# Altium schematic sheet SDCard.SchDoc: SD Card
size A4; Date: 2016-06-28; Author: Vitali Tsiukala; DrawnBy: Vitali Tsiukala; Engineer: Vitali Tsiukala; Organization: Trenz Electronic GmbH; DocumentNumber: TE0706; Revision: 02; SheetNumber: 7; SheetTotal: 10
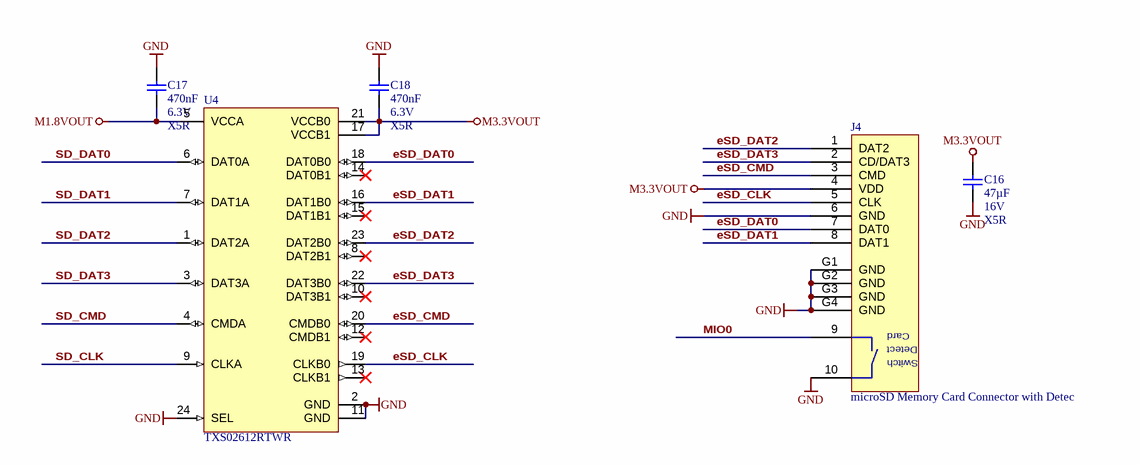
[diagram p0: SDCard.SchDoc]

## Parts
C16  47µF  Voltage: 16V  Technology: X5R  [CAPC3216X180N]
C17  470nF  Voltage: 6.3V  Technology: X5R  [CAPC1005X55N]
C18  470nF  Voltage: 6.3V  Technology: X5R  [CAPC1005X55N]
J4  microSD Memory Card Connector with Detec  [104031-0811]
U4  TXS02612RTWR  [QFN50P400X400X80-25N-255]

## Nets
GND: C16.1 C17.2 C18.2 J4.6(GND) J4.10(CDSW) J4.G1(GND) J4.G2(GND) J4.G3(GND) J4.G4(GND) U4.2(GND) U4.11(GND) U4.24(SEL)
M1.8VOUT: C17.1 U4.5(VCCA)
M3.3VOUT: C16.2 C18.1 J4.4(VDD) U4.17(VCCB1) U4.21(VCCB0)
eSD_CLK: J4.5(CLK) U4.19(CLKB0)
eSD_CMD: J4.3(CMD) U4.20(CMDB0)
eSD_DAT0: J4.7(DAT0) U4.18(DAT0B0)
eSD_DAT1: J4.8(DAT1) U4.16(DAT1B0)
eSD_DAT2: J4.1(DAT2) U4.23(DAT2B0)
eSD_DAT3: J4.2(CD/DAT3) U4.22(DAT3B0)
MIO0: J4.9(CDSW)
SD_CLK: U4.9(CLKA)
SD_CMD: U4.4(CMDA)
SD_DAT0: U4.6(DAT0A)
SD_DAT1: U4.7(DAT1A)
SD_DAT2: U4.1(DAT2A)
SD_DAT3: U4.3(DAT3A)

Not connected (* = marked no-connect by the designer): U4 8(DAT2B1)* 10(DAT3B1)* 12(CMDB1)* 13(CLKB1)* 14(DAT0B1)* 15(DAT1B1)*

## Notes on the sheet
- Title:
- Number:
- Rev.
- Date:
- A4
- Copyright:
- Page
- of
- Filename:
- (in symbol 26322) Card; Detect; Switch

## Library data of the parts
C16 = 24955: KON 47µF 16V  X5R SMD 20%; AN: 24955; Value: 47u; Mixed: SMT; Preferred: Yes; Case: 3216 (1206); Tolerance: 20%
C17 C18 = 23659: KON 470nF 6,3V X5R SMD; AN: 23659; Value: 470n; Mixed: SMT; Preferred: Yes; Case: 1005 (0402)
J4 = 26322: microSD Memory Card Connector with Detect Switch; AN: 26322; Mixed: SMT; Trenz-Stock: Yes; Case: microSD; HelpURL: B:\AD\adlib\datasheet\104031-0811; H-ART: 104031-0811
U4 = 24904: AN: 24904; Trenz-Stock: Yes; Mixed: SMT; Case: QFN24; HelpURL: B:\AD\adlib\datasheet\TXS02612; H-ART: TXS02612RTWR